# EAGLE design Z80 breakout board (EAGLE 5.06)
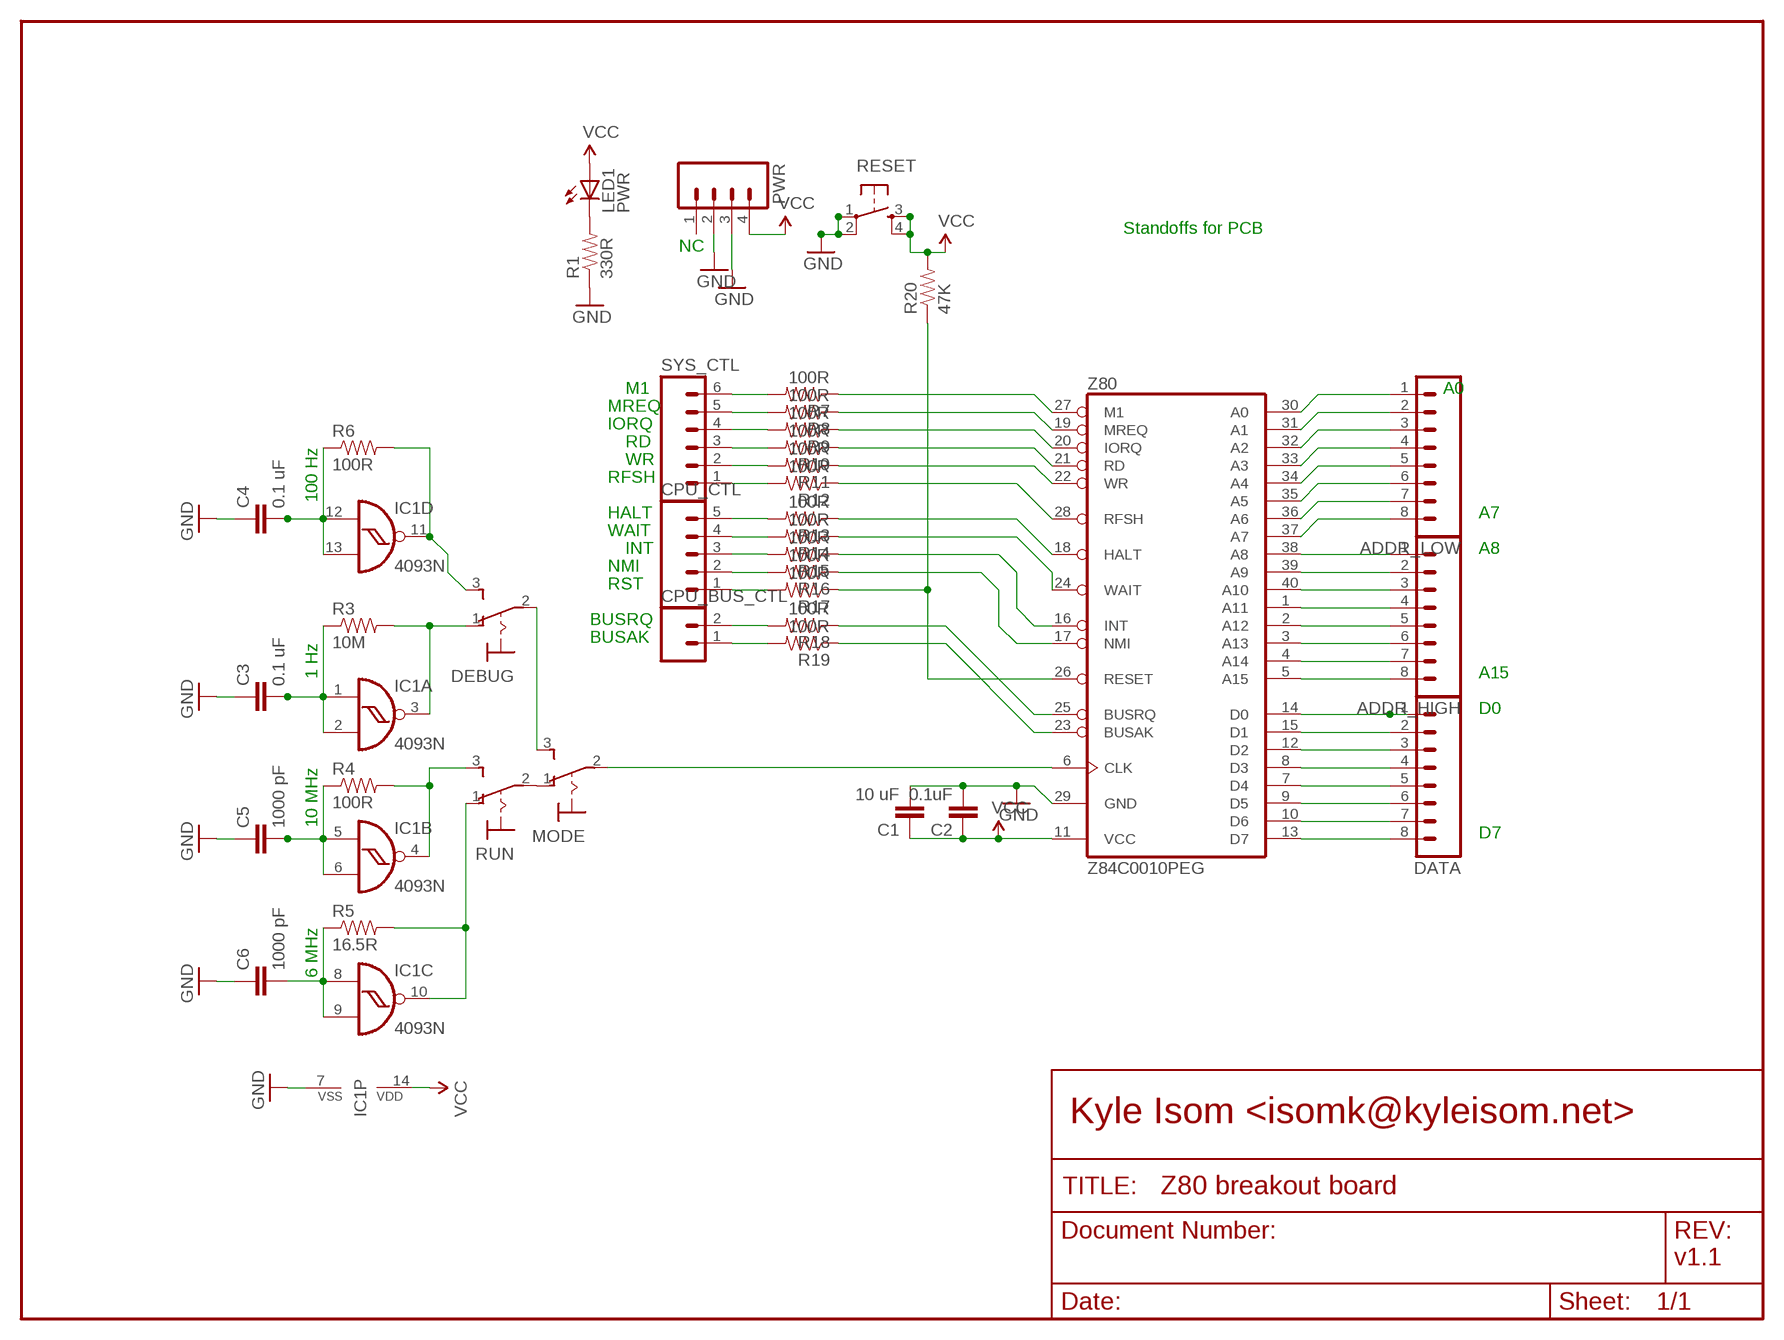
[diagram p0: schematic, sheet 1]

## Parts
ADDR_HIGH  M08  [1X08]
ADDR_LOW  M08  [1X08]
C1  10 uF  CAPPTH1  [CAP-PTH-5MM]
C2  0.1uF  CAPPTH1  [CAP-PTH-5MM]
C3  0.1 uF  CAPPTH1  [CAP-PTH-5MM]
C4  0.1 uF  CAPPTH1  [CAP-PTH-5MM]
C5  1000 pF  CAPPTH1  [CAP-PTH-5MM]
C6  1000 pF  CAPPTH1  [CAP-PTH-5MM]
CPU_BUS_CTL  M02LOCK  [1X02_LOCK]
CPU_CTL  M05LOCK  [1X05_LOCK]
DATA  M08  [1X08]
DEBUG  320-916  [320-916]
IC1  4093N  [DIL14]
LED1  PWR  LED5MM  [LED5MM]
MODE  320-916  [320-916]
PWR  M04POLAR  [MOLEX-1X4]
R1  330R  RESISTORPTH1  [AXIAL-0.3]
R3  10M  RESISTORPTH1  [AXIAL-0.3]
R4  100R  RESISTORPTH1  [AXIAL-0.3]
R5  16.5R  RESISTORPTH1  [AXIAL-0.3]
R6  100R  RESISTORPTH1  [AXIAL-0.3]
R7  100R  RESISTORPTH1  [AXIAL-0.3]
R8  100R  RESISTORPTH1  [AXIAL-0.3]
R9  100R  RESISTORPTH1  [AXIAL-0.3]
R10  100R  RESISTORPTH1  [AXIAL-0.3]
R11  100R  RESISTORPTH1  [AXIAL-0.3]
R12  100R  RESISTORPTH1  [AXIAL-0.3]
R13  100R  RESISTORPTH1  [AXIAL-0.3]
R14  100R  RESISTORPTH1  [AXIAL-0.3]
R15  100R  RESISTORPTH1  [AXIAL-0.3]
R16  100R  RESISTORPTH1  [AXIAL-0.3]
R17  100R  RESISTORPTH1  [AXIAL-0.3]
R18  100R  RESISTORPTH1  [AXIAL-0.3]
R19  100R  RESISTORPTH1  [AXIAL-0.3]
R20  47K  RESISTORPTH1  [AXIAL-0.3]
RESET  TAC_SWITCH12MM  [TACTILE-PTH-12MM]
RUN  320-916  [320-916]
SYS_CTL  M06LOCK  [1X06_LOCK]
Z80  Z84C0010PEG  Z80CPU  [DIL40]

## Nets
GND: C1.2 C2.2 C3.1 C4.1 C5.1 C6.1 IC1.7(P:VSS) PWR.2 PWR.3 R1.P$1 RESET.1 RESET.2 Z80.29(GND)
N$1: ADDR_LOW.1 Z80.30(A0)
N$2: ADDR_LOW.2 Z80.31(A1)
N$3: ADDR_LOW.3 Z80.32(A2)
N$4: ADDR_LOW.4 Z80.33(A3)
N$5: ADDR_LOW.5 Z80.34(A4)
N$6: ADDR_LOW.6 Z80.35(A5)
N$7: ADDR_LOW.7 Z80.36(A6)
N$8: ADDR_LOW.8 Z80.37(A7)
N$9: ADDR_HIGH.1 Z80.38(A8)
N$10: ADDR_HIGH.2 Z80.39(A9)
N$11: ADDR_HIGH.3 Z80.40(A10)
N$12: ADDR_HIGH.4 Z80.1(A11)
N$13: LED1.K(C) R1.P$2
N$14: ADDR_HIGH.5 Z80.2(A12)
N$15: ADDR_HIGH.6 Z80.3(A13)
N$16: ADDR_HIGH.7 Z80.4(A14)
N$17: ADDR_HIGH.8 Z80.5(A15)
N$18: DATA.1 Z80.14(D0)
N$19: DATA.2 Z80.15(D1)
N$20: DATA.3 Z80.12(D2)
N$21: DATA.4 Z80.8(D3)
N$22: DATA.5 Z80.7(D4)
N$23: DATA.6 Z80.9(D5)
N$24: DATA.7 Z80.10(D6)
N$25: DATA.8 Z80.13(D7)
N$26: R17.P$1 R20.P$1 Z80.26(RESET)
N$28: DEBUG.1(O) IC1.3(A:O) R3.P$2
N$29: C6.2 IC1.8(C:I0) IC1.9(C:I1) R5.P$1
N$30: C3.2 IC1.1(A:I0) IC1.2(A:I1) R3.P$1
N$31: C5.2 IC1.5(B:I0) IC1.6(B:I1) R4.P$1
N$32: IC1.4(B:O) R4.P$2 RUN.3(S)
N$33: MODE.2(P) Z80.6(CLK)
N$34: MODE.1(O) RUN.2(P)
N$35: IC1.10(C:O) R5.P$2 RUN.1(O)
N$36: DEBUG.2(P) MODE.3(S)
N$37: C4.2 IC1.12(D:I0) IC1.13(D:I1) R6.P$1
N$38: DEBUG.3(S) IC1.11(D:O) R6.P$2
N$39: R7.P$1 Z80.27(M1)
N$40: R8.P$1 Z80.19(MREQ)
N$41: R9.P$1 Z80.20(IORQ)
N$42: R10.P$1 Z80.21(RD)
N$43: R11.P$1 Z80.22(WR)
N$44: R12.P$1 Z80.28(RFSH)
N$45: R13.P$1 Z80.18(HALT)
N$46: R14.P$1 Z80.24(WAIT)
N$47: R15.P$1 Z80.16(INT)
N$48: R16.P$1 Z80.17(NMI)
N$49: R18.P$1 Z80.25(BUSRQ)
N$50: R19.P$1 Z80.23(BUSAK)
N$51: R7.P$2 SYS_CTL.6
N$52: R8.P$2 SYS_CTL.5
N$53: R9.P$2 SYS_CTL.4
N$54: R10.P$2 SYS_CTL.3
N$55: R11.P$2 SYS_CTL.2
N$56: R12.P$2 SYS_CTL.1
N$57: CPU_CTL.5 R13.P$2
N$58: CPU_CTL.4 R14.P$2
N$59: CPU_CTL.3 R15.P$2
N$60: CPU_CTL.2 R16.P$2
N$61: CPU_BUS_CTL.2 R18.P$2
N$62: CPU_BUS_CTL.1 R19.P$2
N$63: CPU_CTL.1 R17.P$2
VCC: C1.1 C2.1 IC1.14(P:VDD) LED1.A PWR.4 R20.P$2 RESET.3 RESET.4 Z80.11(VCC)
Unconnected: PWR.1

## Notes on the sheet
- Standoffs for PCB
- NC
- M1 | A0
- MREQ
- IORQ
- 100 Hz | RD
- WR
- RFSH
- HALT | A7
- WAIT
- INT | A8
- NMI
- RST
- BUSRQ
- 1 Hz | BUSAK
- A15
- D0
- 10 MHz
- D7
- 6 MHz
- Kyle Isom <isomk@kyleisom.net>
- v1.1

## Library data of the parts
ADDR_HIGH ADDR_LOW DATA = SparkFun:M08: Header 8 Standard 8-pin 0.1" header. Use with straight break away headers (SKU : PRT-00116), right angle break away headers (PRT-00553), swiss pins (PRT-00743), machine pins (PRT-00117), and female headers (PRT-00115).
C1-C6 = SparkFun:CAP: Capacitor Standard 0603 ceramic capacitor, and 0.1" leaded capacitor.
CPU_BUS_CTL = SparkFun:M02: Header 2 Standard 2-pin 0.1" header. Use with straight break away headers (SKU : PRT-00116), right angle break away headers (PRT-00553), swiss pins (PRT-00743), machine pins (PRT-00117), and female headers (PRT-00115). Molex polarized connector foot print use with SKU : PRT-08233 with associated crimp pins and housings.
CPU_CTL = SparkFun:M05: Header 5 Standard 5-pin 0.1" header. Use with straight break away headers (SKU : PRT-00116), right angle break away headers (PRT-00553), swiss pins (PRT-00743), machine pins (PRT-00117), and female headers (PRT-00115). Molex polarized connector foot print use with SKU : PRT-08230 with associated crimp pins and housings.
DEBUG MODE RUN = switch:320-916: TOGGLE SWITCH distributor RS Components
IC1 = 40xx:4093: Quad 2-input NAND schmitt trigger
LED1 = led:LED: LED OSRAM: - CHIPLED LG R971, LG N971, LY N971, LG Q971, LY Q971, LO R971, LY R971 LH N974, LH R974 LS Q976, LO Q976, LY Q976 LO Q996 - Hyper CHIPLED LW Q18S LB Q993, LB Q99A, LB R99A - SideLED LS A670, LO A670, LY A670, LG A670, LP A670 LB A673, LV A673, LT A673, LW A673 LH A674 LY A675 LS A676, LA A676, LO A676, LY A676, LW A676 LS A679, LY A679, LG A679 - Hyper Micro SIDELED® LS Y876, LA Y876, LO Y876, LY Y876 LT Y87S - SmartLED LW L88C, LW L88S LB L89C, LB L89S, LG L890 LS L89K, LO L89K, LY L89K LS L896, LA L896, LO L896, LY L896 - TOPLED LS T670, LO T670, LY T670, LG T670, LP T670 LSG T670, LSP T670, LSY T670, LOP T670, LYG T670 LG T671, LOG T671, LSG T671 LB T673, LV T673, LT T673, LW T673 LH T674 LS T676, LA T676, LO T676, LY T676, LB T676, LH T676, LSB T676, LW T676 LB T67C, LV T67C, LT T67C, LS T67K, LO T67K, LY T67K, LW E67C LS E67B, LA E67B, LO E67B, LY E67B, LB E67C, LV E67C, LT E67C LW T67C LS T679, LY T679, LG T679 LS T770, LO T770, LY T770, LG T770, LP T770 LB T773, LV T773, LT T773, LW T773 LH T774 LS E675, LA E675, LY E675, LS T675 LS T776, LA T776, LO T776, LY T776, LB T776 LHGB T686 LT T68C, LB T68C - Hyper Mini TOPLED® LB M676 - Mini TOPLED Santana® LG M470 LS M47K, LO M47K, LY M47K Source: http://www.osram.convergy.de LUXEON: - LUMILED® LXK2-PW12-R00, LXK2-PW12-S00, LXK2-PW14-U00, LXK2-PW14-V00 LXK2-PM12-R00, LXK2-PM12-S00, LXK2-PM14-U00 LXK2-PE12-Q00, LXK2-PE12-R00, LXK2-PE12-S00, LXK2-PE14-T00, LXK2-PE14-U00 LXK2-PB12-K00, LXK2-PB12-L00, LXK2-PB12-M00, LXK2-PB14-N00, LXK2-PB14-P00, LXK2-PB14-Q00 LXK2-PR12-L00, LXK2-PR12-M00, LXK2-PR14-Q00, LXK2-PR14-R00 LXK2-PD12-Q00, LXK2-PD12-R00, LXK2-PD12-S00 LXK2-PH12-R00, LXK2-PH12-S00 LXK2-PL12-P00, LXK2-PL12-Q00, LXK2-PL12-R00 Source: www.luxeon.com KINGBRIGHT: KA-3528ASYC Source: www.kingbright.com
PWR = SparkFun:M04: Header 4 Standard 4-pin 0.1" header. Use with straight break away headers (SKU : PRT-00116), right angle break away headers (PRT-00553), swiss pins (PRT-00743), machine pins (PRT-00117), and female headers (PRT-00115). Molex polarized connector foot print use with SKU : PRT-08231 with associated crimp pins and housings.
R1 R3-R20 = SparkFun:RESISTOR: Resistor Basic schematic elements and footprints for 0603, 1206, and PTH 1/10th watt (small) resistors.
RESET = SparkFun:TAC_SWITCH: Momentary Switch Button commonly used for reset or general input. Spark Fun Electronics SKU : COM-00097
SYS_CTL = SparkFun:M06: Header 6 Standard 6-pin 0.1" header. Use with straight break away headers (SKU : PRT-00116), right angle break away headers (PRT-00553), swiss pins (PRT-00743), machine pins (PRT-00117), and female headers (PRT-00115). Molex polarized connector foot print use with SKU : PRT-08094 with associated crimp pins and housings. NOTES ON THE VARIANTS LOCK and LOCK_LONGPADS... This footprint was designed to help hold the alignment of a through-hole component (i.e. 6-pin header) while soldering it into place. You may notice that each hole has been shifted either up or down by 0.005 of an inch from it's more standard position (which is a perfectly straight line). This slight alteration caused the pins (the squares in the middle) to touch the edges of the holes. Because they are alternating, it causes a "brace" to hold the component in place. 0.005 has proven to be the perfect amount of "off-center" position when using our standard breakaway headers. Although looks a little odd when you look at the bare footprint, once you have a header in there, the alteration is very hard to notice. Also, if you push a header all the way into place, it is covered up entirely on the bottom side. This idea of altering the position of holes to aid alignment will be further integrated into the Sparkfun Library for other footprints. It can help hold any component with 3 or more connection pins.
Z80 = zilog:Z80CPU: Z80 FAMILY DEVICE

## Board
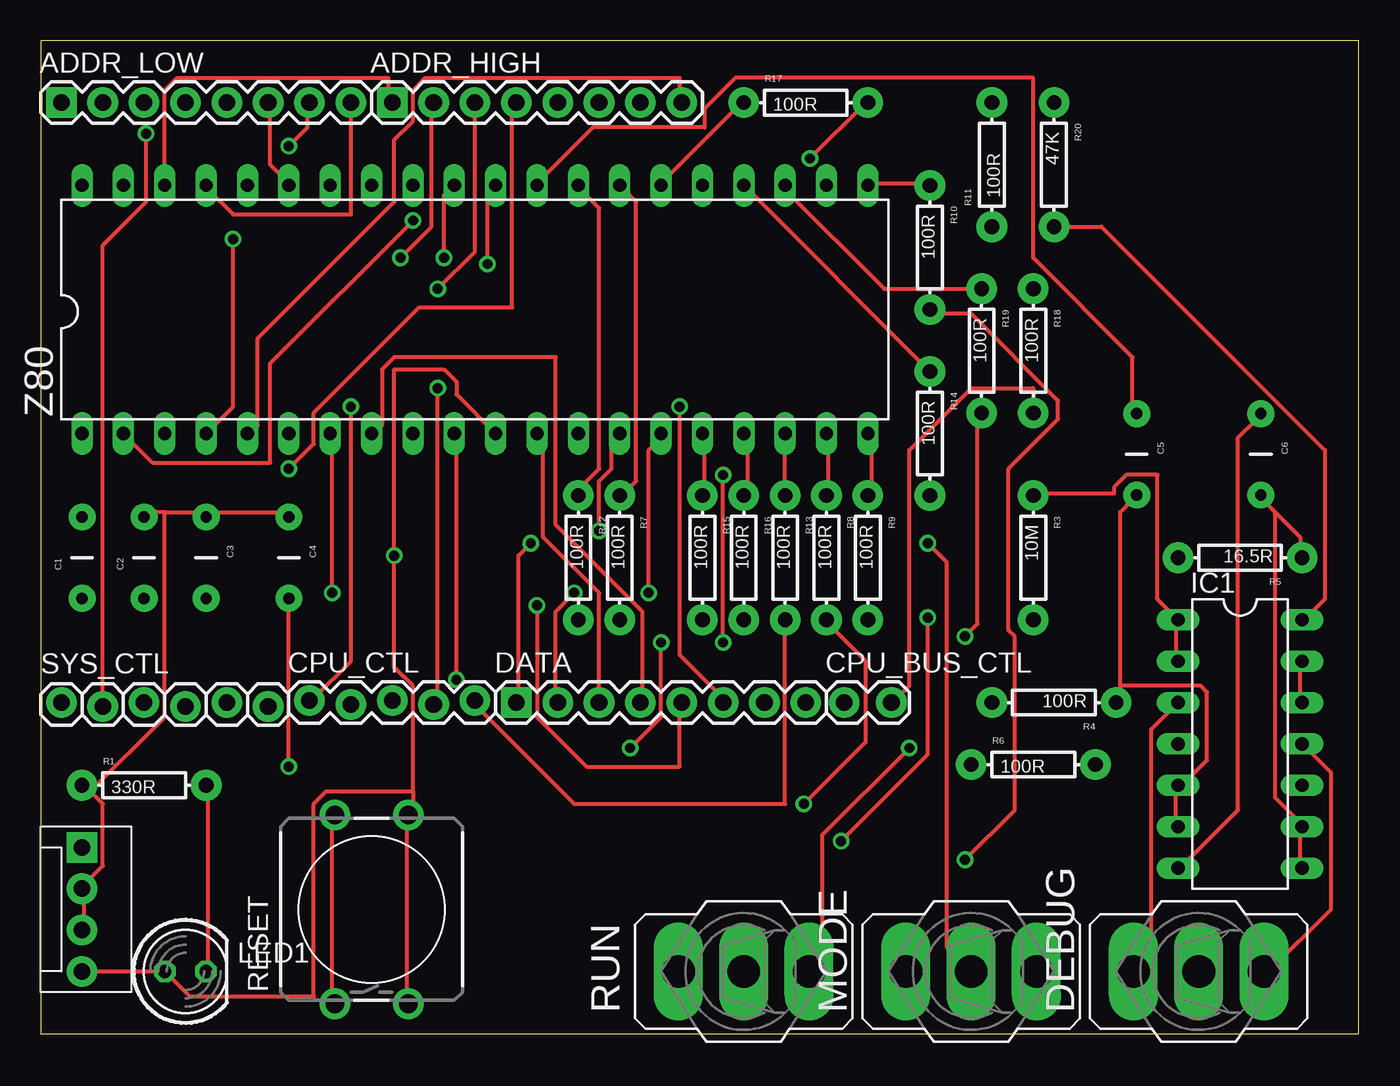
[diagram p1: board, top side]
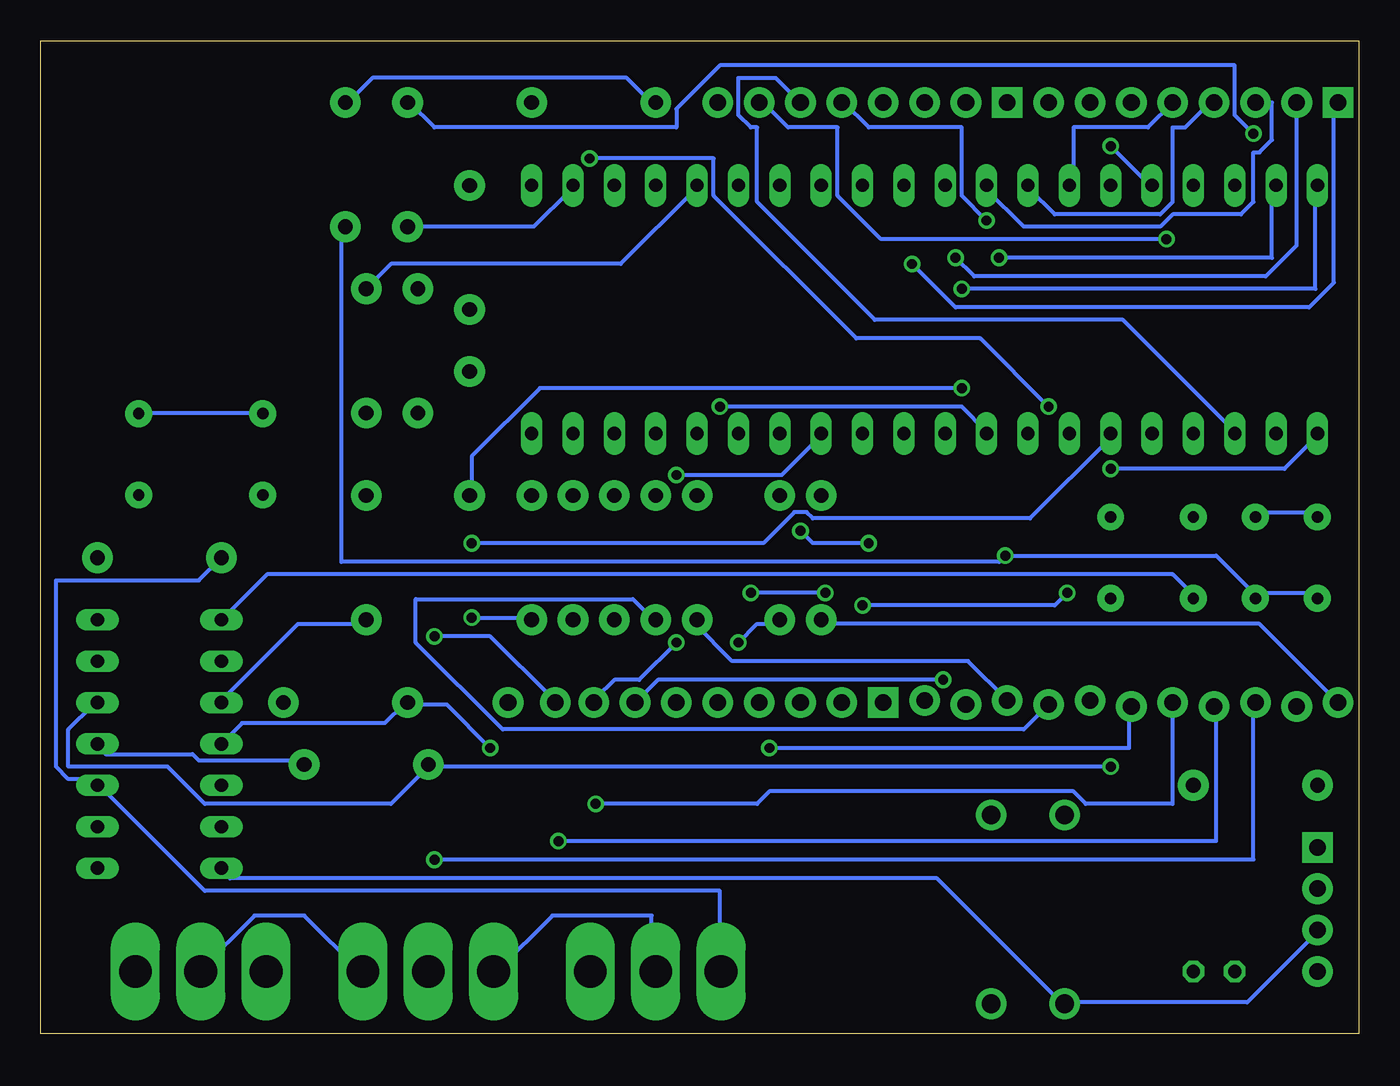
[diagram p2: board, bottom side, seen from below]

Size 80.95 x 60.95 mm. Coordinates in mm from the lower left corner, seen from the top.
Outline: 0,0 80.95,0 80.95,60.95 0,60.95 0,0
Copper layers (1*16): Top 0.035mm / dielectric 1.5mm / Bottom 0.035mm
Design rules "default": minimum track width 10mil, minimum drill 24mil, track to track 8mil, track to pad 8mil, pad to pad 8mil, via to via 8mil, smd to smd 8mil, copper to edge 40mil, drill to drill 8mil, minimum pad ring 10mil, minimum via ring 8mil, stop-mask expansion 4mil, vias tented up to drill 0mil, thermal gap 10mil

### Footprints (pad centres in the part's own frame; a part is rotated, then mirrored left to right if it is on the bottom)
1X08 = drill 1.016 pad 1.88 square: 1 0,0 | drill 1.016 pad 1.88 round: 2 2.54,0; 3 5.08,0; 4 7.62,0; 5 10.16,0; 6 12.7,0; 7 15.24,0; 8 17.78,0
CAP-PTH-5MM = drill 0.7 pad 1.651 round: 1 -2.5,0; 2 2.5,0
1X02_LOCK = drill 1.016 pad 1.88 round: 1 -0.178,0; 2 2.718,0
1X05_LOCK = drill 1.016 pad 1.88 round: 1 0,0.127; 2 2.54,-0.127; 3 5.08,0.127; 4 7.62,-0.127; 5 10.16,0.127
320-916 = drill 2.007 long: 1 0,4.013; 2 0,0; 3 0,-4.013
DIL14 = drill 0.813 long: 1 -7.62,-3.81; 2 -5.08,-3.81; 3 -2.54,-3.81; 4 0,-3.81; 5 2.54,-3.81; 6 5.08,-3.81; 7 7.62,-3.81; 8 7.62,3.81; 9 5.08,3.81; 10 2.54,3.81; 11 0,3.81; 12 -2.54,3.81; 13 -5.08,3.81; 14 -7.62,3.81
LED5MM = drill 0.813 octagon: A -1.27,0; K 1.27,0
MOLEX-1X4 = drill 1.016 pad 1.88 square: 1 0,0 | drill 1.016 pad 1.88 round: 2 2.54,0; 3 5.08,0; 4 7.62,0
AXIAL-0.3 = drill 0.9 pad 1.88 round: P$1 -3.81,0; P$2 3.81,0
TACTILE-PTH-12MM = drill 1.143 pad 1.88 round: 1 -5.791,2.261; 2 5.791,2.261; 3 -5.791,-2.261; 4 5.791,-2.261
1X06_LOCK = drill 1.016 pad 1.88 round: 1 0,0; 2 2.54,-0.254; 3 5.08,0; 4 7.62,-0.254; 5 10.16,0; 6 12.7,-0.254
DIL40 = drill 0.813 long: 1 -24.13,-7.62; 2 -21.59,-7.62; 3 -19.05,-7.62; 4 -16.51,-7.62; 5 -13.97,-7.62; 6 -11.43,-7.62; 7 -8.89,-7.62; 8 -6.35,-7.62; 9 -3.81,-7.62; 10 -1.27,-7.62; 11 1.27,-7.62; 12 3.81,-7.62; 13 6.35,-7.62; 14 8.89,-7.62; 15 11.43,-7.62; 16 13.97,-7.62; 17 16.51,-7.62; 18 19.05,-7.62; 19 21.59,-7.62; 20 24.13,-7.62; 21 24.13,7.62; 22 21.59,7.62; 23 19.05,7.62; 24 16.51,7.62; 25 13.97,7.62; 26 11.43,7.62; 27 8.89,7.62; 28 6.35,7.62; 29 3.81,7.62; 30 1.27,7.62; 31 -1.27,7.62; 32 -3.81,7.62; 33 -6.35,7.62; 34 -8.89,7.62; 35 -11.43,7.62; 36 -13.97,7.62; 37 -16.51,7.62; 38 -19.05,7.62; 39 -21.59,7.62; 40 -24.13,7.62

### Placement (x,y rotation side)
ADDR_HIGH  21.59,57.15 0 top
ADDR_LOW  1.27,57.15 0 top
C1  2.54,29.21 90 top
C2  6.35,29.21 90 top
C3  10.16,29.21 270 top
C4  15.24,29.21 270 top
C5  67.31,35.56 270 top
C6  74.93,35.56 270 top
CPU_BUS_CTL  49.53,20.32 0 top
CPU_CTL  16.51,20.32 0 top
DATA  29.21,20.32 0 top
DEBUG  71.12,3.81 90 top
IC1  73.66,17.78 270 top
LED1  8.89,3.81 0 top
MODE  57.15,3.81 90 top
PWR  2.54,11.43 270 top
R1  6.35,15.24 0 top
R3  60.96,29.21 270 top
R4  62.23,20.32 180 top
R5  73.66,29.21 180 top
R6  60.96,16.51 0 top
R7  35.56,29.21 270 top
R8  48.26,29.21 270 top
R9  50.8,29.21 270 top
R10  54.61,48.26 270 top
R11  58.42,53.34 90 top
R12  33.02,29.21 270 top
R13  45.72,29.21 270 top
R14  54.61,36.83 270 top
R15  40.64,29.21 270 top
R16  43.18,29.21 270 top
R17  46.99,57.15 0 top
R18  60.96,41.91 270 top
R19  57.78,41.91 270 top
R20  62.23,53.34 270 top
RESET  20.32,7.62 90 top
RUN  43.18,3.81 90 top
SYS_CTL  1.27,20.32 0 top
Z80  26.67,44.45 0 top

### Tracks (layer width: path | path; a pad name or v marks a point on that pad's centre or on a via)
GND
  Top 0.254: 7.62,32 6.48,32 C2.2 | 7.62,32 9.91,32 C3.1 10.29,32 15.24,32 C4.1 | PWR.3 2.67,6.48 2.67,8.76 PWR.2 2.67,9.14 3.81,10.29 3.81,14.1 3.05,14.86 | 3.05,14.86 2.67,15.24 R1.P$1 3.05,14.86 | RESET.1 17.91,1.91 17.91,13.34 RESET.2 | 7.62,32 7.62,19.43 3.05,14.86 | IC1.7 70.1,10.29 73.53,13.72 73.53,36.58 74.68,37.72 C6.1 | Z80.29 30.48,52.2 33.91,55.63 40.77,55.63 40.77,56.77 42.67,58.67 60.96,58.67 60.96,47.62 67.06,41.53 67.06,38.1 C5.1
  Bottom 0.254: C1.2 2.67,32 6.1,32 C2.2 | PWR.3 2.67,6.1 6.86,1.91 17.91,1.91 RESET.1 18.29,1.91 25.91,9.53 69.34,9.53 69.72,9.91 IC1.7 | C6.1 74.68,38.1 67.44,38.1 C5.1
N$1  (via drill 0.61)
  Top 0.254: v27.43,47.24 27.43,51.44 27.81,51.82 Z80.30
  Bottom 0.254: v27.43,47.24 24.77,44.58 3.05,44.58 1.52,46.1 1.52,57.15 ADDR_LOW.1
N$2  (via drill 0.61)
  Top 0.254: v24.77,47.62 24.77,51.44 Z80.31
  Bottom 0.254: v24.77,47.62 23.62,46.48 5.71,46.48 3.81,48.39 ADDR_LOW.2
N$3
  Bottom 0.254: Z80.32 22.86,51.82 20.57,49.53 12.19,49.53 11.43,50.29 7.24,50.29 6.48,51.05 6.48,54.1 6.1,54.1 5.33,54.86 5.33,57.15 ADDR_LOW.3
N$4
  Bottom 0.254: Z80.33 20.19,51.82 18.67,50.29 12.19,50.29 11.43,51.05 11.43,55.63 10.67,55.63 9.14,57.15 ADDR_LOW.4
N$5
  Bottom 0.254: ADDR_LOW.5 12.95,55.63 17.53,55.63 17.53,52.2 Z80.34
N$6
  Top 0.254: Z80.35 15.24,52.2 14.1,53.34 14.1,57.15 ADDR_LOW.6
N$7  (via drill 0.61)
  Top 0.254: v15.24,54.48 16.38,55.63 16.38,57.15 ADDR_LOW.7
  Bottom 0.254: v15.24,54.48 12.95,52.2 Z80.36
N$8
  Top 0.254: ADDR_LOW.8 19.05,50.29 11.81,50.29 10.29,51.82 Z80.37
N$9
  Top 0.254: Z80.38 7.62,57.91 8.38,58.67 21.34,58.67 21.34,57.15 ADDR_HIGH.1
N$10  (via drill 0.61)
  Top 0.254: v22.1,47.62 24,49.53 24,57.15 ADDR_HIGH.2
  Bottom 0.254: v22.1,47.62 5.33,47.62 5.33,51.82 Z80.39
N$11  (via drill 0.61)
  Top 0.254: v24.38,45.72 26.67,48.01 ADDR_HIGH.3
  Bottom 0.254: v24.38,45.72 2.67,45.72 2.67,51.82 Z80.40
N$12  (via drill 0.61)
  Top 0.254: v15.24,34.67 16.76,36.2 16.76,38.1 23.24,44.58 28.96,44.58 28.96,57.15 ADDR_HIGH.4
  Bottom 0.254: v15.24,34.67 4.57,34.67 2.67,36.58 Z80.1
N$13
  Top 0.254: LED1.K 10.29,3.81 10.29,15.24 R1.P$2
N$14  (via drill 0.61)
  Top 0.254: v22.86,49.91 14.1,41.15 14.1,35.05 6.86,35.05 Z80.2
  Bottom 0.254: v22.86,49.91 24.38,51.44 24.38,55.63 30.1,55.63 31.62,57.15 ADDR_HIGH.5
N$15
  Bottom 0.254: ADDR_HIGH.6 35.81,58.67 38.1,58.67 38.1,56.39 37.34,55.63 36.96,55.63 36.96,51.05 29.72,43.81 14.48,43.81 7.62,36.96 Z80.3
N$16  (via drill 0.61)
  Top 0.254: v11.81,48.77 11.81,38.48 Z80.4
  Bottom 0.254: v11.81,48.77 29.34,48.77 32,51.44 32,55.63 35.05,55.63 36.58,57.15 ADDR_HIGH.7
N$17
  Top 0.254: Z80.5 12.95,36.96 13.34,37.34 13.34,42.67 21.72,51.05 21.72,54.86 22.86,56.01 22.86,57.91 23.62,58.67 39.24,58.67 39.24,57.15 ADDR_HIGH.8
N$18  (via drill 0.61)
  Top 0.254: v34.29,30.86 34.29,33.91 35.05,34.67 35.05,36.2 35.43,36.58 Z80.14 | v30.1,30.1 29.34,29.34 29.34,20.57 DATA.1
  Bottom 0.254: v34.29,30.86 33.53,30.1 v30.1,30.1
N$19  (via drill 0.61)
  Top 0.254: v37.34,27.05 37.34,35.81 38.1,36.58 Z80.15 | v32.77,27.05 31.62,25.91 31.62,20.57 DATA.2
  Bottom 0.254: v32.77,27.05 v37.34,27.05
N$20
  Top 0.254: Z80.12 30.48,36.58 30.86,36.2 30.86,30.48 34.29,27.05 DATA.3
N$21
  Top 0.254: Z80.8 20.57,36.96 20.95,37.34 20.95,40.77 21.72,41.53 31.62,41.53 31.62,31.24 36.96,25.91 36.96,20.57 DATA.4
N$22  (via drill 0.61)
  Top 0.254: v17.91,27.05 17.91,36.58 Z80.7 | v30.48,26.29 30.48,19.43 33.53,16.38 39.24,16.38 39.24,20.19 DATA.5
  Bottom 0.254: v17.91,27.05 18.67,26.29 v30.48,26.29
N$23  (via drill 0.61)
  Top 0.254: v39.24,38.48 39.24,23.24 41.91,20.57 DATA.6
  Bottom 0.254: v39.24,38.48 24.38,38.48 22.86,36.96 Z80.9
N$24  (via drill 0.61)
  Top 0.254: v25.53,21.72 25.53,36.58 Z80.10
  Bottom 0.254: v25.53,21.72 43.05,21.72 DATA.7
N$25  (via drill 0.61)
  Top 0.254: v41.91,24 v41.91,34.29
  Bottom 0.254: v41.91,34.29 35.43,34.29 33.15,36.58 Z80.13 | v41.91,24 44.2,21.72 45.72,21.72 46.86,20.57 DATA.8
N$26
  Top 0.254: Z80.26 38.1,52.2 43.05,57.15 R17.P$1
  Bottom 0.254: R20.P$1 62.1,57.15 60.58,58.67 44.96,58.67 43.43,57.15 R17.P$1
N$28
  Top 0.254: DEBUG.1 67.44,3.81 68.2,4.57 68.2,18.67 IC1.3
  Bottom 0.254: IC1.3 69.72,20.57 65.15,25.15 60.96,25.15 R3.P$2
N$29
  Top 0.254: IC1.8 77.34,10.29 77.34,12.57 IC1.9 77.34,12.95 75.82,14.48 75.82,32 | 75.82,32 77.34,30.48 77.34,29.34 R5.P$1 | 75.82,32 75.06,32.77 C6.2
N$30
  Top 0.254: IC1.2 69.72,22.86 69.72,25.15 IC1.1 68.58,26.67 68.58,34.29 66.67,34.29 65.91,33.53 65.91,33.15 60.96,33.15 R3.P$1
  Bottom 0.254: C3.2 10.29,27.05 11.43,28.19 67.06,28.19 IC1.1
N$31
  Top 0.254: IC1.6 69.72,12.95 69.72,15.24 IC1.5 70.1,15.24 71.63,16.76 71.63,20.95 71.25,21.34 66.29,21.34 | 66.29,21.34 66.29,20.57 R4.P$1 | 66.29,21.34 66.29,32 67.06,32.77 C5.2
N$32  (via drill 0.61)
  Top 0.254: v53.34,17.53 48.01,12.19 48.01,4.57 47.24,3.81 RUN.3
  Bottom 0.254: IC1.4 68.58,19.05 59.82,19.05 58.67,20.19 R4.P$2 58.29,20.19 56.01,20.19 v53.34,17.53
N$33  (via drill 0.61)
  Top 0.254: v54.48,30.1 55.63,28.96 55.63,5.33 MODE.2
  Bottom 0.254: v54.48,30.1 36.58,30.1 34.67,32 33.91,32 33.53,31.62 20.19,31.62 15.24,36.58 Z80.6
N$34
  Bottom 0.254: RUN.2 43.43,3.81 43.43,7.24 49.53,7.24 52.96,3.81 MODE.1
N$35
  Bottom 0.254: R5.P$2 71.25,27.81 80.01,27.81 80.01,16.38 79.25,15.62 78.11,15.62 77.72,15.24 IC1.10 77.34,15.24 70.87,8.76 39.24,8.76 39.24,3.81 RUN.1
N$36
  Bottom 0.254: MODE.3 61.34,3.81 64.77,7.24 67.82,7.24 71.25,3.81 DEBUG.2
N$37  (via drill 0.61)
  Top 0.254: IC1.12 77.34,20.57 77.34,22.86 IC1.13 | v15.24,16.38 C4.2
  Bottom 0.254: v15.24,16.38 57.15,16.38 | 57.15,16.38 59.44,14.1 70.87,14.1 73.15,16.38 79.25,16.38 79.25,18.67 77.72,20.19 IC1.12 | 57.15,16.38 R6.P$1
N$38
  Top 0.254: DEBUG.3 75.44,3.81 79.25,7.62 79.25,16 IC1.11
  Bottom 0.254: IC1.11 77.34,17.53 76.96,17.14 71.63,17.14 71.25,16.76 64.77,16.76 R6.P$2
N$39
  Top 0.254: Z80.27 36.58,51.05 36.58,33.91 35.81,33.15 R7.P$1
N$40
  Top 0.254: Z80.19 48.39,36.58 48.39,33.15 R8.P$1
N$41
  Top 0.254: Z80.20 51.05,36.58 51.05,33.15 R9.P$1
N$42
  Top 0.254: Z80.21 51.05,52.2 54.48,52.2 R10.P$1
N$43
  Bottom 0.254: Z80.22 48.39,51.82 50.67,49.53 R11.P$1
N$44
  Top 0.254: Z80.28 33.15,51.82 34.29,50.67 34.29,34.67 33.15,33.53 33.15,33.15 R12.P$1
N$45
  Top 0.254: R13.P$1 Z80.18
N$46
  Top 0.254: Z80.24 R14.P$1
N$47
  Top 0.254: Z80.16 40.77,36.58 40.77,33.15 R15.P$1
N$48
  Top 0.254: Z80.17 43.43,36.58 43.43,33.15 R16.P$1
N$49
  Bottom 0.254: R18.P$1 59.44,47.24 45.34,47.24 40.77,51.82 Z80.25
N$50
  Top 0.254: Z80.23 45.72,51.82 51.82,45.72 R19.P$1
N$51  (via drill 0.61)
  Top 0.254: v36.2,17.53 38.1,19.43 v38.1,24
  Bottom 0.254: v36.2,17.53 14.1,17.53 14.1,19.81 SYS_CTL.6 | v38.1,24 36.96,25.15 35.81,25.15 R7.P$2
N$52  (via drill 0.61)
  Top 0.254: v46.86,14.1 50.67,17.91 50.67,22.86 48.39,25.15 R8.P$2
  Bottom 0.254: v46.86,14.1 36.96,14.1 36.2,14.86 17.53,14.86 16.76,14.1 11.43,14.1 SYS_CTL.5
N$53  (via drill 0.61)
  Top 0.254: v49.15,11.81 54.48,17.14 v54.48,25.53
  Bottom 0.254: v49.15,11.81 8.76,11.81 8.76,19.81 SYS_CTL.4 | v54.48,25.53 51.05,25.53 R9.P$2
N$54  (via drill 0.61)
  Top 0.254: v56.77,10.67 59.82,13.72 59.82,24.38 59.44,24.77 59.44,34.67 62.48,37.72 62.48,38.86 57.15,44.2 54.86,44.2 R10.P$2
  Bottom 0.254: v56.77,10.67 6.48,10.67 6.48,20.19 SYS_CTL.3
N$55  (via drill 0.61)
  Top 0.254: v6.48,55.24 6.48,51.05 3.81,48.39 SYS_CTL.2
  Bottom 0.254: v6.48,55.24 7.62,56.39 7.62,59.44 39.24,59.44 41.91,56.77 41.91,55.63 56.77,55.63 58.29,57.15 R11.P$2
N$56
  Bottom 0.254: SYS_CTL.1 6.1,25.15 32.77,25.15 R12.P$2
N$57
  Top 0.254: CPU_CTL.5 26.67,20.19 32.77,14.1 45.72,14.1 R13.P$2
N$58  (via drill 0.61)
  Top 0.254: v24.38,39.62 24.38,20.19 CPU_CTL.4
  Bottom 0.254: v24.38,39.62 50.29,39.62 54.48,35.43 54.48,33.15 R14.P$2
N$59
  Bottom 0.254: CPU_CTL.3 24,22.86 38.48,22.86 40.77,25.15 R15.P$2
N$60
  Bottom 0.254: CPU_CTL.2 20.57,18.67 52.58,18.67 57.91,24 57.91,26.67 44.58,26.67 43.43,25.53 R16.P$2
N$61
  Top 0.254: R18.P$2 60.96,39.62 57.15,39.62 53.34,35.81 53.34,21.34 52.58,20.57 CPU_BUS_CTL.2
N$62  (via drill 0.61)
  Top 0.254: v56.77,24.38 57.53,25.15 57.53,38.1 R19.P$2
  Bottom 0.254: v56.77,24.38 53.34,24.38 49.53,20.57 CPU_BUS_CTL.1
N$63  (via drill 0.61)
  Top 0.254: v19.05,38.48 19.05,22.86 16.76,20.57 CPU_CTL.1 | v47.24,53.72 50.67,57.15 R17.P$2
  Bottom 0.254: v19.05,38.48 23.24,42.67 30.86,42.67 39.62,51.44 39.62,53.72 v47.24,53.72
VCC  (via drill 0.61)
  Top 0.254: IC1.14 77.72,25.53 78.87,26.67 78.87,35.81 65.15,49.53 R20.P$2 | PWR.4 LED1.A 9.14,2.29 16.76,2.29 16.76,14.1 17.53,14.86 22.86,14.86 | 22.86,14.86 22.86,13.72 RESET.4 22.48,13.34 22.48,1.91 RESET.3 | 22.86,14.86 22.86,21.34 21.72,22.48 v21.72,29.34 21.72,40.77 24.77,40.77 25.53,40.01 25.53,39.24 Z80.11
  Bottom 0.254: C1.1 2.67,27.05 6.1,27.05 C2.1 6.48,27.05 8.76,29.34 v21.72,29.34 22.1,28.96 62.48,28.96 62.48,49.53 R20.P$2